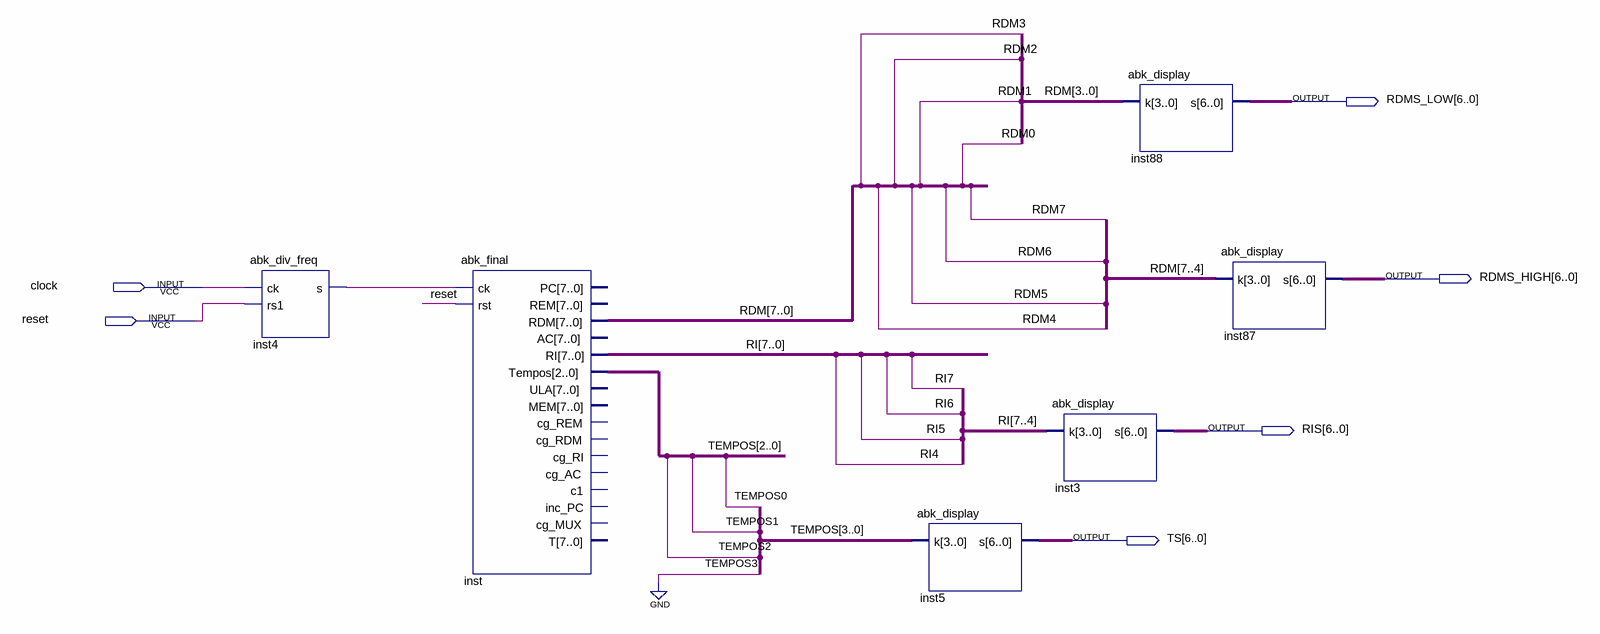
[diagram p0: schematic sheet]
// Quartus schematic abk_funciona_por_favor.bdf as structural Verilog: 6 symbols, 6 pins
module abk_funciona_por_favor (
  input  clock,
  input  reset,
  output [6:0] RDMS_LOW,
  output [6:0] RDMS_HIGH,
  output [6:0] RIS,
  output [6:0] TS
);

  wire inst4_s;
  wire [2:0] TEMPOS;
  wire [7:0] RDM, RI;

  abk_div_freq inst4 (.ck(clock), .rs1(reset), .s(inst4_s));
  abk_final inst (
    .ck(inst4_s), .rst(reset), .RDM(RDM), .RI(RI), .Tempos(TEMPOS));  // open: PC, REM, AC, ULA, MEM, cg_REM, cg_RDM, cg_RI, cg_AC, c1, inc_PC, cg_MUX, T
  abk_display inst5 (.k({1'b0, TEMPOS}), .s(TS));
  abk_display inst3 (.k(RI[7:4]), .s(RIS));
  abk_display inst88 (.k(RDM[3:0]), .s(RDMS_LOW));
  abk_display inst87 (.k(RDM[7:4]), .s(RDMS_HIGH));
endmodule
